# Altium schematic sheet GateWay-NRF-version-commande.SchDoc
size A4
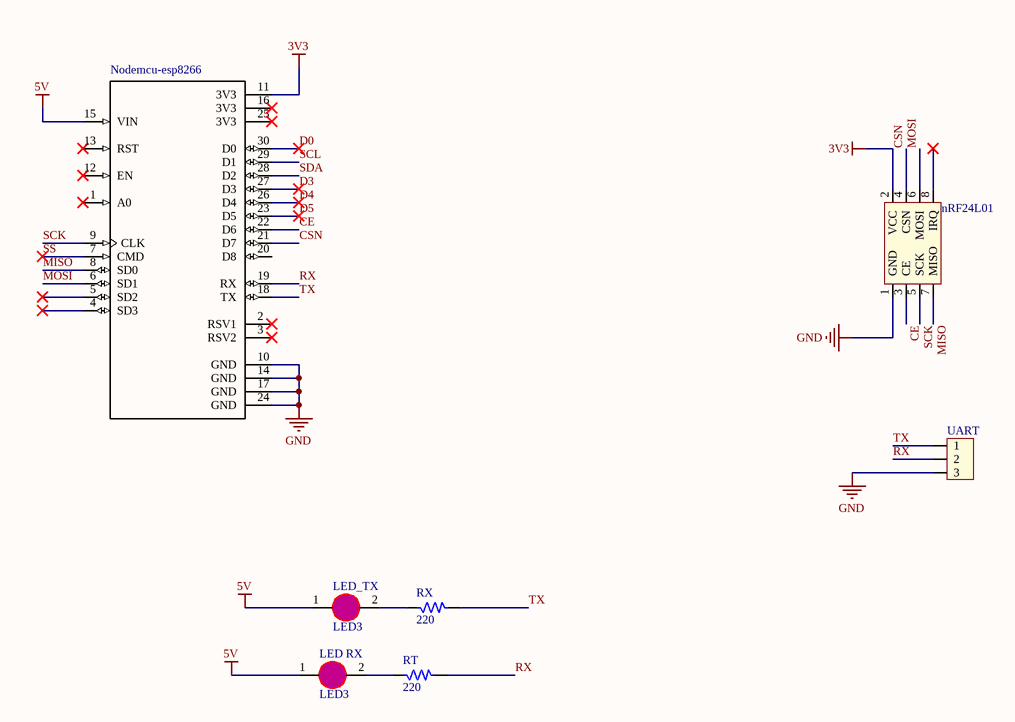
[diagram p0: GateWay-NRF-version-commande.SchDoc]

## Parts
LED_RX  LED3  [LED0805]
LED_TX  LED3  [LED0805]
Nodemcu-esp8266  ZC563900  [*MODULE_ZC563900]  (value not drawn)
nRF24L01  nRF24L01  [nRF24L01]  (value not drawn)
RT  220  [SM-1206]
RX  220  [SM-1206]
UART  UART  [CON3]  (value not drawn)

## Nets
3V3: Nodemcu-esp8266.11(3V3) nRF24L01.2(VCC)
5V: LED_RX.1(A) LED_TX.1(A) Nodemcu-esp8266.15(VIN)
GND: Nodemcu-esp8266.10(GND) Nodemcu-esp8266.14(GND) Nodemcu-esp8266.17(GND) Nodemcu-esp8266.24(GND) nRF24L01.1(GND) UART.3
CE: Nodemcu-esp8266.22(D6) nRF24L01.3(CE)
CSN: Nodemcu-esp8266.21(D7) nRF24L01.4(CSN)
D0: Nodemcu-esp8266.30(D0)
D3: Nodemcu-esp8266.27(D3)
D4: Nodemcu-esp8266.26(D4)
D5: Nodemcu-esp8266.23(D5)
MISO: Nodemcu-esp8266.8(SD0) nRF24L01.7(MISO)
MOSI: Nodemcu-esp8266.6(SD1) nRF24L01.6(MOSI)
RX: Nodemcu-esp8266.19(RX) RT.2 UART.2
SCK: Nodemcu-esp8266.9(CLK) nRF24L01.5(SCK)
SCL: Nodemcu-esp8266.29(D1)
SDA: Nodemcu-esp8266.28(D2)
SS: Nodemcu-esp8266.7(CMD)
TX: Nodemcu-esp8266.18(TX) RX.2 UART.1
NetLED_RX_2: LED_RX.2(K) RT.1
NetLED_TX_2: LED_TX.2(K) RX.1

Not connected (* = marked no-connect by the designer): Nodemcu-esp8266 1(A0)* 2(RSV1)* 3(RSV2)* 4(SD3)* 5(SD2)* 12(EN)* 13(RST)* 16(3V3)* 20(D8) 25(3V3)*; nRF24L01 8(IRQ)*

## Library data of the parts
LED_RX LED_TX = LEDSMD: LED 3mm
Nodemcu-esp8266 = ZC563900: NodeMcu Lua ESP8266 WIFI Internet of Things Network Development Module Board; MF: YKS; Package: None; Availability: Unavailable; MP: ZC563900; SnapEDA_Link: https://www.snapeda.com/parts/ZC563900/YKS/view-part/607853/?ref=snap; Price: None; Value: *
RT RX = R: Resistor 1/4W; Value: R1/4W - 1K
UART = Con3: Connector 3; Value: Connector 3